# EasyEDA Pro project ProProject_BBM-USB_2024-03-22.epro, board PCB_BSBM-USB-O_1
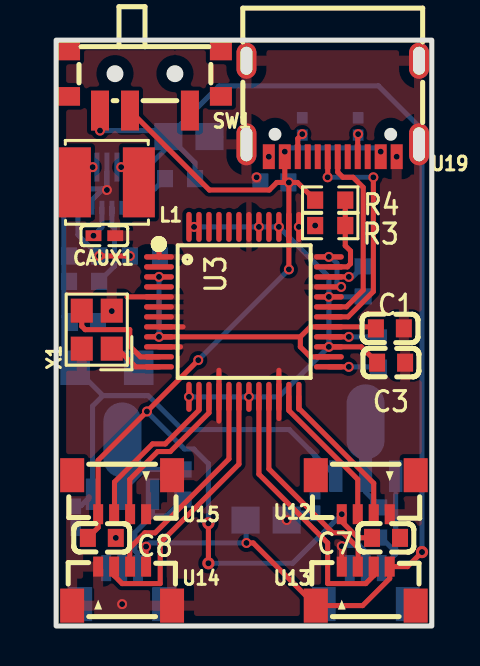
[diagram p3: board, top side]
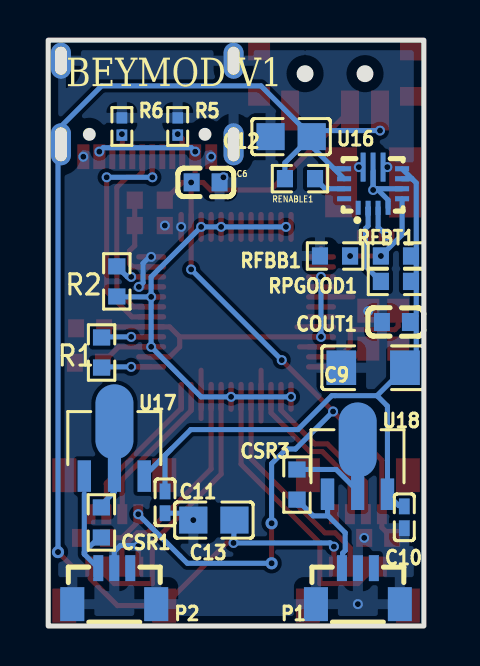
[diagram p4: board, bottom side, seen from below]

Outline 18.8 x 29.3 mm; copper layers: Top Layer, Bottom Layer. Coordinates in mm from the lower left corner of the outline.
Outline path: rectangle 0,29.3 18.8,0
Stack: Top Layer 0.035mm / Dielectric1 1.51mm FR4 er 4.5 / Bottom Layer 0.035mm

## Design rules (mm)
spacing Default (default): track to track 0.152, other pairs 0 to 0.152
track width Default (default): min 0.254, default 0.254, max 25.4
differential pair differentialPair (default): width min 0.127, default 0.254, max 2.54; gap min 0.152, default 0.152
via Default (default): diameter min 0.61, default 0.61, max 100.025; hole min 0.305, default 0.305, max 59.995

## Placement (name value [footprint] x y rotation side)
C1  10uF  [C0603]  16.7 14.89 180 top
C3  10uF  [C0603]  16.76 13.17 0 top
C6  100nF  [C0603]  10.92 22.19 0 bottom
C7  100nF  [C0603]  16.51 4.41 0 top
C8  100nF  [C0603]  2.29 4.41 0 top
C9  47uF  [C1206]  2.54 12.92 0 bottom
C10  100nF  [C0402]  0.98 5.44 90 bottom
C11  100nF  [C0402]  12.95 6.19 90 bottom
C12  22uF  [C0805]  6.64 24.48 180 bottom
C13  22uF  [C0805]  10.51 5.3 180 bottom
CAUX1  100nF  [C0402]  2.41 19.52 180 top
COUT1  10uF  [C0603]  1.4 15.2 180 bottom
CSR1  536Ω  [R0603]  16.14 5.18 270 bottom
CSR3  536Ω  [R0603]  6.35 7.08 270 bottom
L1  2.2uH  [IND-SMD_L4.0-W4.0]  2.54 22.19 180 top
P1  SM03B-SURS-TF(LF)(SN)  [CONN-SMD_SM03B-SURS-TF-LF-SN]  3.3 1.99 0 bottom
P2  SM03B-SURS-TF(LF)(SN)  [CONN-SMD_SM03B-SURS-TF-LF-SN]  15.49 1.99 0 bottom
R1  2.7kΩ  [R0603]  16.13 13.68 90 bottom
R2  100kΩ  [R0603]  15.37 17.23 270 bottom
R3  100kΩ  [R0603]  13.72 20.03 0 top
R4  47kΩ  [R0603]  13.72 21.3 0 top
R5  5.1kΩ  [R0402]  12.32 24.98 270 bottom
R6  5.1kΩ  [R0402]  15.11 24.98 270 bottom
RENABLE1  10kΩ  [R0603]  6.2 22.37 180 bottom
RFBB1  100kΩ  [R0603]  4.44 18.5 180 bottom
RFBT1  845kΩ  [R0603]  1.4 18.5 180 bottom
RPGOOD1  100kΩ  [R0603]  1.4 17.23 180 bottom
SW1  MK-12C02-G020  [SW-SMD_MK-12C02-G020]  4.44 27.27 180 top
U3  FE1.1-AQFP48A  [LQFP-48_L7.0-W7.0-P0.50-LS9.0-BL]  9.4 15.71 270 top
U12  SM04B-SURS-TF(LF)(SN)  [CONN-SMD_SM04B-SURS-TF-LF-SN]  15.49 6.57 180 top
U13  SM04B-SURS-TF(LF)(SN)  [CONN-SMD_SM04B-SURS-TF-LF-SN]  15.49 1.99 0 top
U14  SM04B-SURS-TF(LF)(SN)  [CONN-SMD_SM04B-SURS-TF-LF-SN]  3.3 1.99 0 top
U15  SM04B-SURS-TF(LF)(SN)  [CONN-SMD_SM04B-SURS-TF-LF-SN]  3.3 6.57 180 top
U16  TPS63070RNMR  [VQFN-HR-15_L3.0-W2.5-P0.50-BL_TPS63070RNMR]  2.54 21.93 180 bottom
U17  LM317LIPK  [SOT-89_L4.5-W2.5-P1.50-LS4.2-BR]  15.49 8.85 270 bottom
U18  LM317LIPK  [SOT-89_L4.5-W2.5-P1.50-LS4.2-BR]  3.32 7.95 270 bottom
U19  GT-USB-7010ASV  [USB-C-SMD_G-SWITCH_GT-USB-7010ASV]  13.84 25.87 180 top
X1  -  [OSC-SMD_4P-L2.5-W2.0-BL]  2.03 14.82 90 top

## Footprints (pads in the part's own frame, mm; a bottom-side part is the same pattern mirrored in y, then rotated)
C0402
  rect 0.79x0.54 smd: 1(-0.545,0) 2(0.545,0)
C0603
  rect 0.8x0.9 smd: 1(-0.7,0) 2(0.7,0)
C0805
  rect 1.41x1.35 smd: 1(-1.03,0) 2(1.03,0)
C1206
  rect 1.485x1.728 smd: 1(-1.593,0) 2(1.593,0)
CONN-SMD_SM03B-SURS-TF-LF-SN
  rect 0.5x1.3 smd: 1(0.8,-0.899) 2(0,-0.899) 3(-0.8,-0.9)
  rect 1.2x1.7 smd: 4(-2.1,0.9) 5(2.1,0.9)
CONN-SMD_SM04B-SURS-TF-LF-SN
  rect 0.5x1 smd: 1(-1.2,0.975) 2(-0.4,0.975) 3(0.4,0.975) 4(1.2,0.975)
  rect 1.2x1.7 smd: 5(2.5,-0.975) 6(-2.5,-0.975)
IND-SMD_L4.0-W4.0
  rect 1.6x3.5 smd: 1(-1.6,0) 2(1.6,0)
LQFP-48_L7.0-W7.0-P0.50-LS9.0-BL
  oval 0.27x1.5 smd: 1(-2.75,-4.25) 2(-2.25,-4.25) 3(-1.75,-4.25) 4(-1.25,-4.25) 5(-0.75,-4.25) 6(-0.25,-4.25) 7(0.25,-4.25) 8(0.75,-4.25) 9(1.25,-4.25) 10(1.75,-4.25) 11(2.25,-4.25) 12(2.75,-4.25) 25(2.75,4.25) 26(2.25,4.25) 27(1.75,4.25) 28(1.25,4.25) 29(0.75,4.25) 30(0.25,4.25) 31(-0.25,4.25) 32(-0.75,4.25) 33(-1.25,4.25) 34(-1.75,4.25) 35(-2.25,4.25) 36(-2.75,4.25)
  oval 1.5x0.27 smd: 13(4.25,-2.75) 14(4.25,-2.25) 15(4.25,-1.75) 16(4.25,-1.25) 17(4.25,-0.75) 18(4.25,-0.25) 19(4.25,0.25) 20(4.25,0.75) 21(4.25,1.25) 22(4.25,1.75) 23(4.25,2.25) 24(4.25,2.75) 37(-4.25,2.75) 38(-4.25,2.25) 39(-4.25,1.75) 40(-4.25,1.25) 41(-4.25,0.75) 42(-4.25,0.25) 43(-4.25,-0.25) 44(-4.25,-0.75) 45(-4.25,-1.25) 46(-4.25,-1.75) 47(-4.25,-2.25) 48(-4.25,-2.75)
OSC-SMD_4P-L2.5-W2.0-BL
  rect 1.2x1.1 smd: 1(-0.95,-0.75) 2(0.95,-0.75) 3(0.95,0.75) 4(-0.95,0.75)
R0402
  rect 0.566x0.54 smd: 1(-0.433,0) 2(0.433,0)
R0603
  rect 0.806x0.864 smd: 1(-0.753,0) 2(0.753,0)
SOT-89_L4.5-W2.5-P1.50-LS4.2-BR
  rect 1.575x0.672 smd: 1(1.356,-1.5) 3(1.356,1.5)
  custom 5.377x1.9 smd: 2(-1.356,0.009)
SW-SMD_MK-12C02-G020
  rect 0.9x2 smd: 1(-2.25,1.49) 2(0.75,1.49) 3(2.25,1.49)
  rect 1.1x0.93 smd: 4(3.8,0.779) 5(3.8,-1.49) 6(-3.8,-1.49) 7(-3.8,0.779)
USB-C-SMD_G-SWITCH_GT-USB-7010ASV
  oval 1x2.1 hole 0.6x1.7: 1(-4.32,1.78) 2(4.32,1.78)
  oval 1x1.8 hole 0.6x1.4: 3(4.32,-2.4) 4(-4.32,-2.4)
  rect 0.6x1.24 smd: A1B12(-3.2,2.4) A4B9(-2.4,2.4) B1A12(3.2,2.4) B4A9(2.4,2.4)
  rect 0.3x1.24 smd: A5(-1.25,2.4) A6(-0.25,2.4) A7(0.25,2.4) A8(1.25,2.4) B5(1.75,2.4) B6(0.75,2.4) B7(-0.75,2.4) B8(-1.75,2.4)
VQFN-HR-15_L3.0-W2.5-P0.50-BL_TPS63070RNMR
  rect 0.25x0.7 smd: 1(-0.75,-1.016) 2(-0.25,-1.016) 3(0.25,-1.016) 4(0.75,-1.016)
  rect 0.7x0.25 smd: 5(1.45,-0.566) 6(1.45,-0.066) 7(1.45,0.434) 8(1.45,0.934) 12(-1.45,0.434) 13(-1.45,0.934) 14(-1.45,-0.066) 15(-1.45,-0.566)
  rect 0.25x1.45 smd: 9(0.5,1.016) 11(-0.5,1.016)
  rect 0.25x1.85 smd: 10(0,0.817)

## Nets
7.5VO: C9.1 C10.2 C11.2 COUT1.2 RFBT1.2 RPGOOD1.2 U16.7 U16.8 U17.3 U18.3
GND: C1.1 C3.2 C6.1 C7.2 C8.2 C9.2 C10.1 C11.1 C12.1 C13.1 CAUX1.1 COUT1.1 P1.2 P1.4 P1.5 P2.2 P2.4 P2.5 R3.1 R5.1 R6.1 RFBB1.1 U3.1 U3.5 U3.6 U3.7 U3.8 U3.10 U3.16 U3.22 U3.33 U3.36 U3.37 U3.42 U12.1 U13.1 U14.1 U14.5 U14.6 U15.1 U15.6 U16.4 U16.6 U16.10 U19.1 U19.2 U19.3 U19.4 U19.A1B12 U19.B1A12 X1.2 X1.4
VBUS_5V: C6.2 C7.1 C8.1 R4.1 SW1.2 U3.38 U12.4 U15.4 U19.A4B9 U19.B4A9
VCC1_8V: C1.2 U3.3 U3.9 U3.26 U3.29
VCC3_3V: C3.1 R2.2 U3.13 U3.19 U3.27 U3.32 U3.39 U3.41 U3.47 U3.48
DM1: U3.23 U12.3
DM2: U3.20 U13.3
DM3: U3.17 U14.3
DM4: U3.14 U15.3
DMU: U3.30 U19.A7
DP1: U3.24 U12.2
DP2: U3.21 U13.2
DP3: U3.18 U14.2
DP4: U3.15 U15.2
DPU: U3.31 U19.A6
IRO1: CSR3.2 P1.1 U18.1
IRO2: CSR1.2 P2.1 U17.1
USBO: C12.2 C13.2 RENABLE1.1 SW1.3 U13.4 U13.6 U14.4 U16.12 U16.13
$1N99: U3.12 X1.1
$1N100: U3.11 X1.3
$1N318: R1.2 U3.28
$1N319: R1.1 U3.25
$1N387: R3.2 R4.2 U3.35
$1N521: R2.1 U3.34
$1N1863: CSR1.1 U17.2
$1N1867: CSR3.1 U18.2
$1N1872: CAUX1.2 U16.3
$1N1873: RPGOOD1.1 U16.2
$1N1874: RFBB1.2 RFBT1.1 U16.5
$1N1875: L1.2 U16.9
$1N1876: L1.1 U16.11
$1N6428: RENABLE1.2 U16.14
$1N11513: R5.2 U19.B5
$1N11542: R6.2 U19.A5

Pads without a net: P1 3; P2 3; SW1 1 4 5 6 7; U3 2 4 40 43 44 45 46; U12 5 6; U13 5; U15 5; U16 1 15; U19 A8 B6 B7 B8

## Via types
v1: diameter 0.5, hole 0.3, Top Layer to Bottom Layer, 44 vias
v2: diameter 0.61, hole 0.305, Top Layer to Bottom Layer, 3 vias

## Routing (per net, layer and track width the routed paths; a pad name or vN(x,y) marks a point on that pad's centre or on a via; arc(x,y) is an arc through that point)
7.5VO: length 35.4
  Bottom Layer w0.254: 0.38,15.49 0.67,15.2 COUT1.2 ; 2.34,11.52 C9.1 0.38,13.48 0.38,18.24 RFBT1.2 0.38,18.77 0.38,22.16 0.59,22.37 ; 2.34,11.52 1.82,11 U18.3 1.25,6.02 1.02,6.02 ; 2.34,11.52 4.61,11.52 6.3,9.82 11.67,9.82 U17.3 ; 12.64,8.85 12.95,8.54 C11.2 ; 0.59,22.37 U16.7 ; 0.59,22.37 U16.8
GND: length 20
  Top Layer w0.254: U3.5 3.55,16.46 ; 14.29,2.99 v1(14.29,3.99) ; U3.1 5.15,18.89 ; U3.8 6.35,14.96 ; 8.15,12.79 U3.16 8.15,10.25 ; 11.15,10.38 U3.22 11.15,12.79 ; U3.10 6.22,13.96
  Bottom Layer w0.254: 7.64,24.48 8.24,24.48 ; U16.10 v1(2.54,21.81) 2.48,21.87 2.35,21.87 ; U16.6 2.35,21.87 ; 2.35,21.87 1.79,21.31 U16.4 ; v1(14.26,16.96) 14.05,17.17 14.05,18.14 13.73,18.46 v1(13.65,18.46) ; C11.1 11.88,5.64 v1(11.54,5.3) ; P2.2 15.49,3.72 15.19,4.03 14.33,4.03 v1(14.29,3.99)
  vias: v1(2.78,15.75) v1(2.99,4.41) v1(3.3,1.09) v1(10.03,22.44) v1(10.64,23.47) v1(12.15,19.96) v1(12.96,20.03) v1(17.04,23.47)
VBUS_5V: length 59.1
  Top Layer w0.254: v2(7.62,5.14) v2(7.62,3.14) ; 13.02,21.35 R4.1 12.08,22.18 v1(11.65,22.18) ; v1(14.29,5.59) 14.29,5.22 15.1,4.41 15.8,4.41 C7.1 ; v1(11.44,23.72) 11.44,22.37 11.62,22.19 ; SW1.2 7.67,21.81 10.67,21.81 11.04,22.18 v1(11.65,22.18) ; v1(11.65,22.18) U3.38 v1(11.65,17.83) ; C8.1 2.1,4.92 U15.4 2.1,8.29 v1(4.54,10.73) v1(7.11,13.3)
  Bottom Layer w0.254: v1(4.54,10.73) 6.42,8.85 6.89,8.85 7.62,8.12 v2(7.62,5.14) ; v2(7.62,3.14) 11.84,3.14 v1(14.29,5.59) ; v1(16.24,23.72) 16.05,23.92 11.64,23.92 v1(11.44,23.72) ; v1(11.65,17.83) v1(7.11,13.3)
VCC1_8V: length 16.2
  Top Layer w0.254: v1(5.15,14.46) 12.22,14.46 ; 12.22,14.46 12.72,14.96 U3.29 15.93,14.96 C1.2 ; 12.22,14.46 12.22,13.96 12.72,13.46 U3.26
  Bottom Layer w0.254: v1(5.15,17.46) v1(5.15,14.46)
VCC3_3V: length 23.8
  Top Layer w0.254: C3.1 15.27,13.96 v1(13.65,13.96)
  Bottom Layer w0.254: v1(6.65,11.46) v1(9.65,11.46) 11.15,11.46 v1(13.65,13.96) v1(13.65,16.46) ; v1(13.65,16.46) 15.35,16.46 R2.2 ; v1(13.65,16.46) 13.65,17.46 v1(11.15,19.96) v1(10.15,19.96) v1(6.9,19.96)
DMU: length 11.8
  Top Layer w0.254: v1(13.59,22.44) 13.59,22.45 13.59,23.47 ; U3.30 14.61,15.46 15.88,16.73 v1(15.88,22.44)
  Bottom Layer w0.254: v1(13.59,22.44) v1(15.88,22.44)
DPU: length 9.6
  Top Layer w0.254: 14.09,23.47 14.09,22.7 14.35,22.44 14.86,22.44 15.37,21.93 15.37,16.8 14.53,15.96 U3.31
USBO: length 64
  Top Layer w0.254: v2(18.31,3.7) 17.58,2.97 U13.4 16.69,2.38 15.34,1.02 U13.6 9.86,4.15 v1(9.53,4.15) ; v1(4.5,3.97) U14.4
  Bottom Layer w0.254: 5.64,24.48 6.95,23.17 RENABLE1.1 ; v1(9.53,4.15) 4.69,4.15 v1(4.5,3.97) ; C12.2 8.15,27.01 16.13,27.01 18.31,24.83 v2(18.31,3.7) ; C12.2 5.31,24.78 v1(2.19,24.78) ; C12.2 5.61,23.99 4.49,22.87 ; U16.13 4.49,22.87 ; 4.49,22.87 U16.12 ; 9.51,4.17 9.51,5.3
$1N100: length 5.8
  Top Layer w0.254: U3.11 4.22,13.46 3.68,14 3.68,14.82 1.45,14.82 1.28,14.99 X1.3
$1N318: length 2.5
  Top Layer w0.254: U3.28 v1(14.65,14.46)
  Bottom Layer w0.254: v1(14.65,14.46) 16.1,14.46 R1.2
$1N319: length 2.5
  Top Layer w0.254: v1(14.65,12.96) U3.25
  Bottom Layer w0.254: R1.1 16.09,12.96 v1(14.65,12.96)
$1N387: length 4.4
  Top Layer w0.254: R4.2 R3.2 14.47,19.02 14.73,18.76 14.73,18.12 14.57,17.96 U3.35
$1N521: length 1.9
  Top Layer w0.254: v1(14.65,17.46) U3.34
  Bottom Layer w0.254: v1(14.65,17.46) 14.84,17.46 R2.1
$1N1872: length 1.6
  Bottom Layer w0.254: v1(1.87,19.52) 2.29,19.94 U16.3
$1N1873: length 4.4
  Bottom Layer w0.254: 2.79,20.54 2.79,20.91 U16.2 2.79,20.01 2.92,19.88 2.92,18 2.16,17.23 RPGOOD1.1
$1N1874: length 4.8
  Top Layer w0.254: v1(2.15,18.5) v1(3.69,18.5)
  Bottom Layer w0.254: U16.5 1.09,19.57 v1(2.15,18.5)
$1N1875: length 1.2
  Top Layer w0.254: v1(1.83,22.95) 1.07,22.19 L1.2
$1N1876: length 1.2
  Top Layer w0.254: v1(3.25,22.95) 3.38,22.95 L1.1
$1N11513: length 1.2
  Top Layer w0.254: 12.09,23.47 12.09,24.38 v1(12.32,24.6)
$1N11542: length 1.1
  Top Layer w0.254: 15.09,23.47 15.09,24.58 v1(15.11,24.6)
DM1: length 7.3
  Top Layer w0.254: U3.23 11.65,10.78 15.09,7.33 U12.3
DM2: length 13.7
  Top Layer w0.254: U3.20 10.15,7.59 13.59,4.15 13.59,2.12 15.49,2.12 15.89,2.52 U13.3
DM3: length 10.9
  Top Layer w0.254: U14.3 3.68,2.99 3.68,3.9 4.44,4.66 4.95,4.66 8.65,8.36 U3.17
DM4: length 8
  Top Layer w0.254: U15.3 2.92,5.61 2.92,7.2 4.83,9.11 5.46,9.11 7.15,10.79 U3.14
DP1: length 7.4
  Top Layer w0.254: U3.24 12.15,10.88 15.89,7.14 U12.2
DP2: length 10.7
  Top Layer w0.254: 10.67,11.44 U3.21 10.65,7.86 13.84,4.66 14.35,4.66 15.11,3.9 15.11,2.99 U13.2
DP3: length 13.9
  Top Layer w0.254: U14.2 2.9,2.52 3.3,2.12 5.21,2.12 5.21,4.15 9.15,8.09 U3.18
DP4: length 7.9
  Top Layer w0.254: U15.2 3.68,5.61 3.68,7.33 5.08,8.73 5.72,8.73 7.65,10.66 U3.15
IRO1: length 6
  Bottom Layer w0.254: P1.1 4.06,2.93 4.06,3.65 3.94,3.77 3.94,4.66 4.82,5.55 U18.1 ; 4.85,5.51 5.54,5.51 CSR3.2
IRO2: length 5.3
  Bottom Layer w0.254: 16.14,4.55 16.99,3.7 16.99,3.59 ; 16.99,6.61 16.99,3.59 ; 16.99,3.59 P2.1
$1N99: length 2.9
  Top Layer w0.254: 2.78,14.15 3.97,12.96 U3.12
$1N1863: length 4.4
  Bottom Layer w0.254: U17.2 15.49,6.71 16.14,6.06
$1N1867: length 3.5
  Bottom Layer w0.254: 3.3,6.74 4.39,7.83 CSR3.1
$1N6428: length 1.7
  Bottom Layer w0.254: U16.14 4.94,21.87 RENABLE1.2

## Copper pours and planes (outline as drawn; the poured copper is in the pictures)
GND on Top Layer: -2.67,29.43 18.92,29.43 18.92,-2.2 -2.67,-2.2
GND on Bottom Layer: -0.13,31.46 21.46,31.46 21.46,-0.16 -0.13,-0.16

## Text on the board
Bottom Silkscreen Layer: BEYMOD V1
